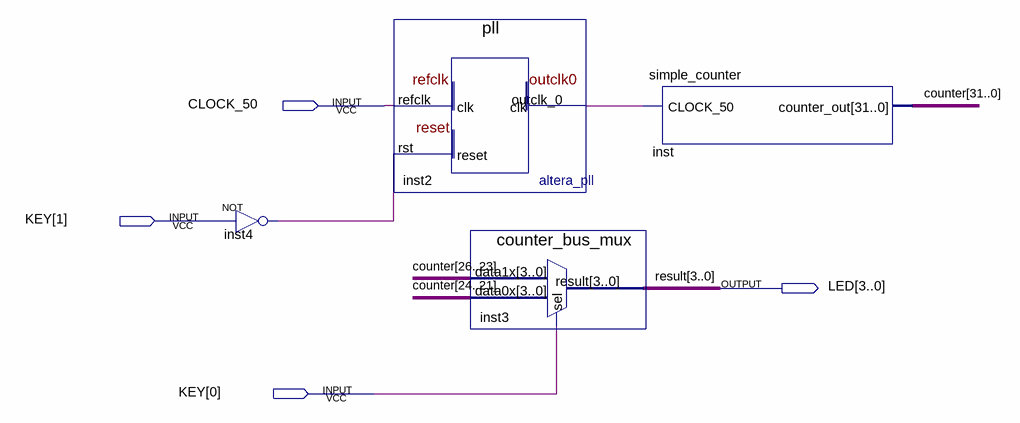
[diagram p0: schematic sheet]
// Quartus schematic lab0.bdf as structural Verilog: 4 symbols, 4 pins
module lab0 (
  input  CLOCK_50,
  input  [1:0] KEY,
  output [3:0] LED
);

  wire inst2_outclk_0, inst4_out;
  wire [31:0] counter;

  not inst4 (inst4_out, KEY[1]);
  pll inst2 (.refclk(CLOCK_50), .rst(inst4_out), .outclk_0(inst2_outclk_0));
  counter_bus_mux inst3 (.data1x(counter[26:23]), .data0x(counter[24:21]), .sel(KEY[0]), .result(LED));
  simple_counter inst (.CLOCK_50(inst2_outclk_0), .counter_out(counter));

  // Other names for the same wires on the sheet: result[3:0] = LED
endmodule
